# Altium schematic sheet COMM.SchDoc
size A4
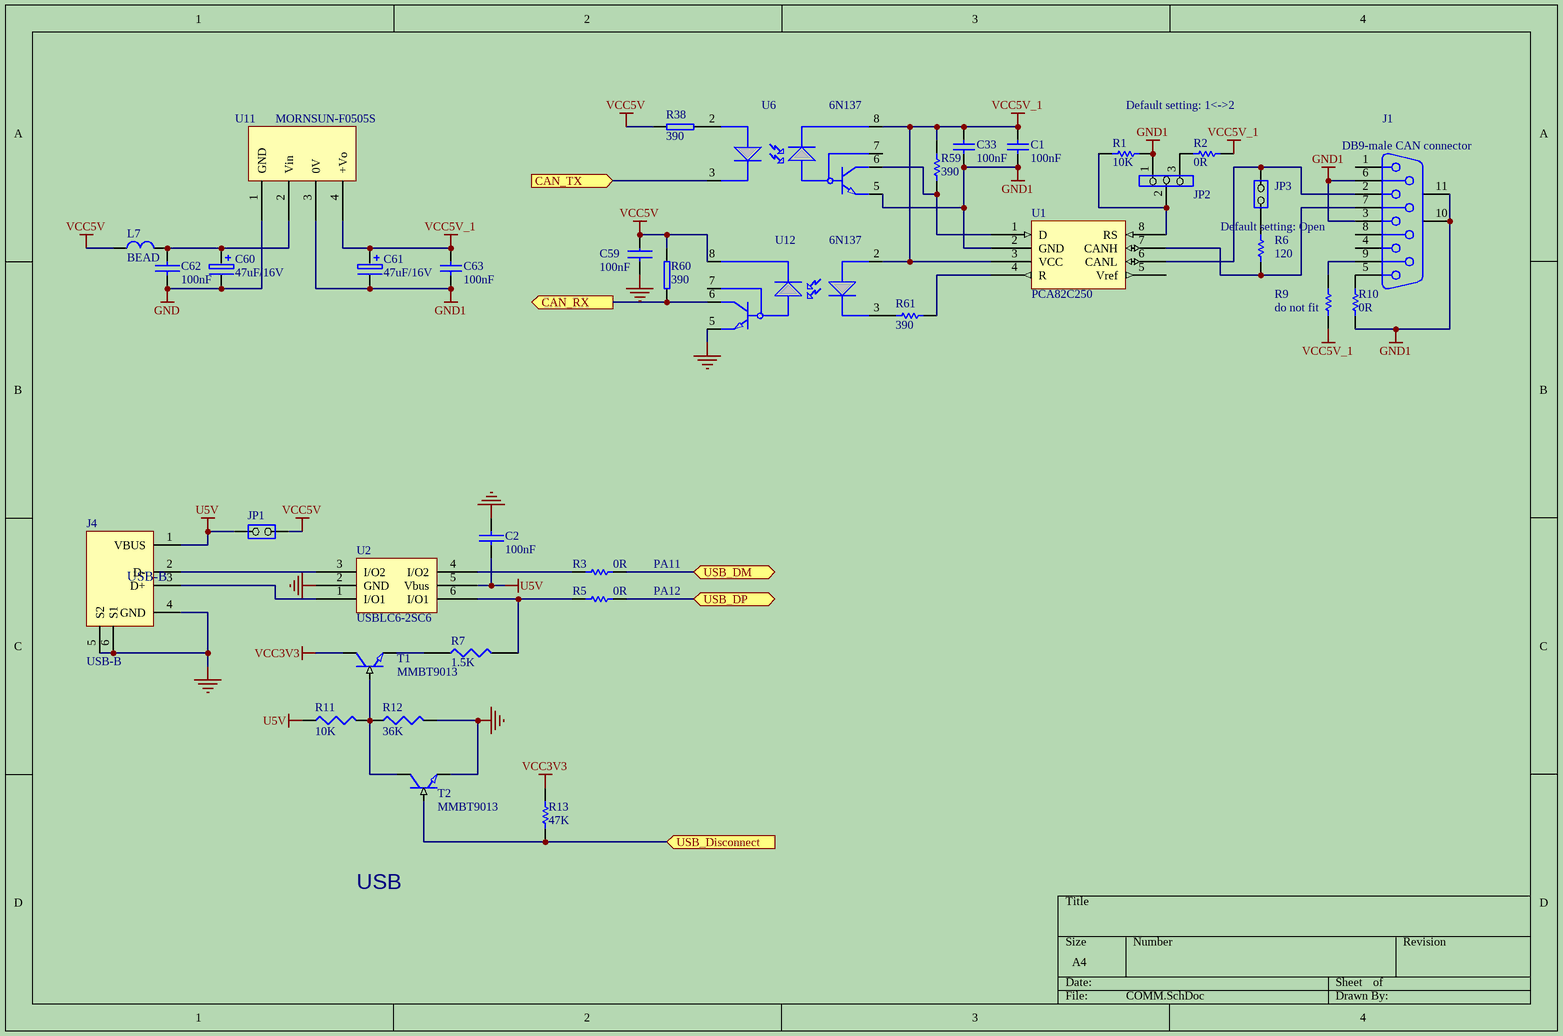
[diagram p0: COMM.SchDoc]

## Parts
C1  100nF  [C0805]
C2  100nF  [C0805]
C33  100nF  [C0805]
C59  100nF  [C0805]
C60  47uF/16V  [CD1/2]
C61  47uF/16V  [CD1/2]
C62  100nF  [C0805]
C63  100nF  [C0805]
J1  DB9-male CAN connector  [DSUB1.385-2H9]
J4  USB-B  [USB-B]
JP1  (no value)  [SIP2]
JP2  (no value)  [SIP3]
JP3  (no value)  [SIP2]
L7  BEAD  [L0805]
R1  10K  [R0805]
R2  0R  [R0805]
R3  0R  [R0805]
R5  0R  [R0805]
R6  120  [R0805]
R7  1.5K  [R0805]
R9  do not fit  [R0805]
R10  0R  [R0805]
R11  10K  [R0805]
R12  36K  [R0805]
R13  47K  [R0805]
R38  390  [R0805]
R59  390  [R0805]
R60  390  [R0805]
R61  390  [R0805]
T1  MMBT9013  [SOT-23]
T2  MMBT9013  [SOT-23]
U1  PCA82C250  [SO8]
U2  USBLC6-2SC6  [SOT-23/6]
U6  6N137  [DIP8]
U11  MORNSUN-F0505S  [MORNSUN-BM]
U12  6N137  [DIP8]

## Ports
CAN_RX (out), CAN_TX (in), USB_Disconnect (in), USB_DM (bidir), USB_DP (bidir)

## Nets
GND: C2.1 C59.2 C60.2 C62.2 J4.4(GND) J4.5(S2) J4.6(S1) R12.2 T2.2(E) U2.2(GND) U11.1(GND) U12.5
GND1: C1.2 C33.2 C61.2 C63.2 J1.3 J1.6 J1.10(MH1) J1.11(MH2) JP2.1 R1.2 R10.1 U1.2(GND) U6.5 U11.3(0V)
U5V: C2.2 J4.1(VBUS) JP1.2(NO) R11.1 U2.5(Vbus)
VCC3V3: R13.2 T1.3(C)
VCC5V: C59.1 JP1.1(COMMON) L7.1 R38.2 R60.1 U12.8
VCC5V_1: C1.1 C33.1 C61.1 C63.1 R2.2 R9.1 R59.2 U1.3(VCC) U6.8 U11.4(+Vo) U12.2
CAN_RX: R60.2 U12.6 ; port CAN_RX
CAN_TX: U6.3 ; port CAN_TX
USB_Disconnect: R13.1 T2.1(B) ; port USB_Disconnect
USB_DM: R3.1 ; port USB_DM
USB_DP: R5.1 ; port USB_DP
NetC60_1: C60.1 C62.1 L7.2 U11.2(Vin)
NetJ1_2: J1.2 JP3.2(NO) U1.6(CANL)
NetJ1_5: J1.5 R10.2
NetJ1_7: J1.7 R6.1 U1.7(CANH)
NetJ1_9: J1.9 R9.2
NetJ4_2: J4.2(D-) U2.3(I/O2)
NetJ4_3: J4.3(D+) U2.1(I/O1)
NetJP2_2: JP2.2 R1.1 U1.8(RS)
NetJP2_3: JP2.3 R2.1
NetJP3_1: JP3.1(COMMON) R6.2
NetR3_2: R3.2 U2.4(I/O2)
NetR5_2: R5.2 R7.2 U2.6(I/O1)
NetR7_1: R7.1 T1.2(E)
NetR11_2: R11.2 R12.1 T1.1(B) T2.3(C)
NetR38_1: R38.1 U6.2
NetR59_1: R59.1 U1.1(D) U6.6
NetR61_1: R61.1 U1.4(R)
NetR61_2: R61.2 U12.3

Not connected (* = marked no-connect by the designer): J1 1 4 8; U1 5(Vref); U6 7; U12 7

## Notes on the sheet
- Default setting: 1<->2
- (near R6) Default setting: Open
- PA11
- PA12
- USB

## Library data of the parts
C1 C2 C33 C63 = CAP: Capacitor
  C1 C33 C63: Published: 8-Jun-2000; Revision: July-2002: Re-released for DXP Platform.; Publisher: Altium Limited; Value: 100nF
C59 = CAP NP: Text Field1: 20; Text Field2: 10
C60 C61 = CD1: Electrolytic Capacitor; Text Field1: 4.7uF:4V-A;6.3V-A;10V-A;16V-BA;20V-BA;25V-CB;35V-DC;50V-D;; Text Field2: 10uF:4V-AB;6.3V-BA;10V-BA;16V-CBA;20V-CB;25V-DC;35V-D;; Text Field3: 22uF:4V-BA;6.3V-CBA;10V-CB;16V-DBC;20V-DC;25V-D;35V-D;; Text Field4: 33uF:4V-CAB;6.3V-CBA;10V-DBC;16V-DCB;20V-DC;25V-DE;; Text Field5: 47uF:4V-CBA;6.3V-DBC;10V-DBC;16V-DC;20V-DE;; Text Field6: 68uF:4V-DBC;6.3V-DCB;10V-DCB;16V-D;20V-DE;; Text Field7: 100uF:4V-DCB;6.3V-EDBC;10V-DC;16V-DE;20V-E;; Text Field8: 220uF:4V-EDC;6.3V-ED;10V-ED;
C62 = CC: Capacitor
J1 = D Connector 9: Receptacle Assembly, 9 Position, Right Angle; PackageDocument: O; Positions: 9; Published: 15-Jun-2001; LatestRevisionDate: 17-Jul-2002; LatestRevisionNote: Re-released for DXP Platform.; DatasheetDocument: 1-Sep-1999; PackageReference: 788750; Publisher: Altium Limited; Orientation: Right Angle; Gender: Receptacle
JP1 JP3 = JP2
JP2 = Jumper3
L7 = L1
R1 R2 R6 R9 R10 = res1: Resistor; Value: 1K; Published: 8-Jun-2000; Revision: July-2002: Re-released for DXP Platform.; Publisher: Altium Limited
R3 R5 R13 R59 R61 = Res1: Resistor; Value: 1K; Published: 8-Jun-2000; Publisher: Altium Limited
  R3 R5 R13: Revision: July-2002: Re-released for DXP Platform.
  R59 R61: LatestRevisionDate: 17-Jul-2002; LatestRevisionNote: Re-released for DXP Platform.; PackageReference: AXIAL-0.3
R7 = RES1
R11 R12 = R: Right: 20; Bottom: 30
R38 R60 = R: Resistor; Text Field1: 0402-1/16W-50V; Text Field2: 0603-1/16W-50V; Text Field3: 0805-1/10W-150V; Text Field4: 1206-1/8W-200V; Text Field5: 1210-1/4W-200V; Text Field6: 2010-1/2W-200V--2512-1W-200V; Text Field7: For G 2 %,J 5 % ( E - 24 ) 10 11 12 13 15 16 18 20 22 24 27 30 33 36 39 43 47 51 56 62 68 75 82 91; Text Field8: For F 1 % ( E - 96 ) 100 102 105 107 110 113 115 118 121 124 127 130 133 137 140 143 147 150 154 158 162 165 169 174 178 182 187 191 196 200 205 210 215 221 226 232 237 243 249 255 261 267 174 280 287 294 301 309 316 324 332 340 348 357 365 374 383 392 40
T1 T2 = NPN_SOT23: Text Field1: 22; Text Field2: 22
U1 = SN65HVD230D
U2 = USBLC6-2
U6 U12 = 6N136: Text Field1: 110; Text Field2: 50
U11 = MORNSUN-BM: MORNSUN Fixed input,Isolated,Unregulated Series DC/DC